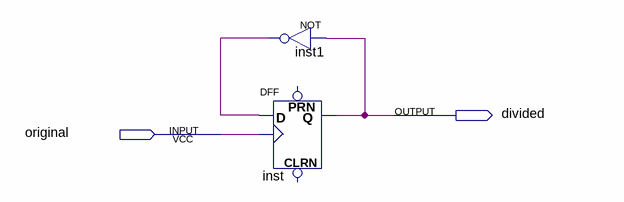
[diagram p0: schematic sheet]
// Quartus schematic divide2.bdf as structural Verilog: 2 symbols, 2 pins
module divide2 (
  input  original,
  output divided
);

  wire inst1_out;

  not inst1 (inst1_out, divided);
  DFF inst (.CLK(original), .D(inst1_out), .Q(divided));  // open: CLRN, PRN
endmodule
